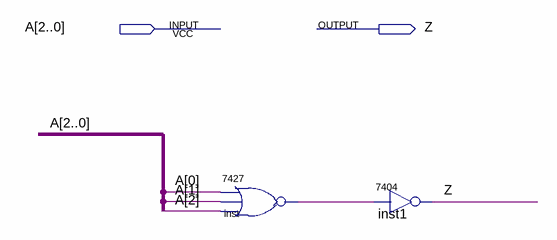
[diagram p0: schematic sheet]
// Quartus schematic or_3in.bdf as structural Verilog: 2 symbols, 2 pins
module or_3in (
  input  [2:0] A,
  output Z
);

  wire inst_1;

  \7427  inst (.\4 (A[2]), .\3 (A[1]), .\2 (A[0]), .\1 (inst_1));
  \7404  inst1 (.\2 (inst_1), .\1 (Z));
endmodule
